# Altium schematic sheet digital-isolator-3in-1out-power.SchDoc
size A3; DocumentNumber: 3; SheetNumber: 3; SheetTotal: 5; SheetDescription: Digital Isolator 3x in / 1x out with power
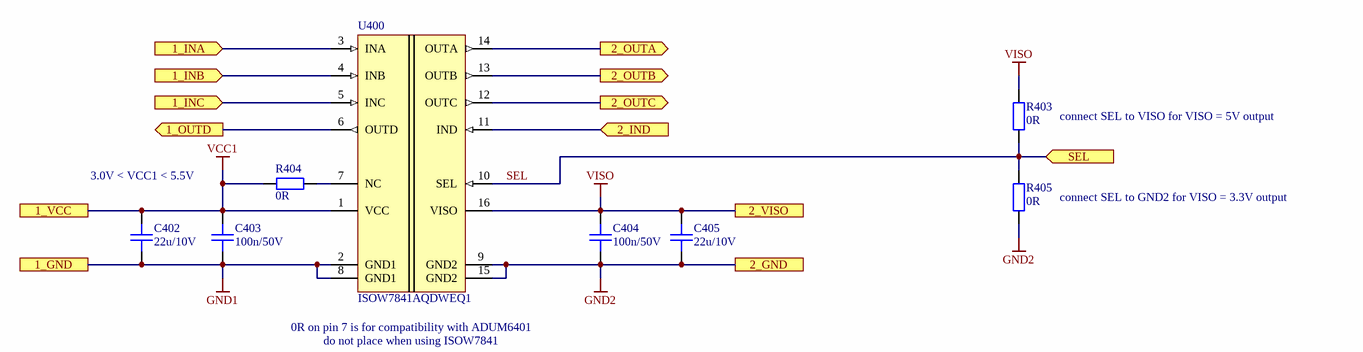
[diagram p0: digital-isolator-3in-1out-power.SchDoc]

## Parts
C402  22u/10V  [CAPC3216X18N]
C403  100n/50V  [CAPC1608X08N]
C404  100n/50V  [CAPC1608X08N]
C405  22u/10V  [CAPC3216X18N]
R403  0R  [RESC1608X05N]
R404  0R  [RESC1608X05N]
R405  0R  [RESC1608X05N]
U400  ISOW7841AQDWEQ1  [TI_DWE0016A]

## Ports
1_GND, 1_INA (in), 1_INB (in), 1_INC (in), 1_OUTD (out), 1_VCC, 2_GND, 2_IND (in), 2_OUTA (out), 2_OUTB (out), 2_OUTC (out), 2_VISO, SEL (in)

## Nets
GND1: C402.1 C403.1 U400.2(GND1) U400.8(GND1) ; port 1_GND
GND2: C404.1 C405.1 R405.1 U400.9(GND2) U400.15(GND2) ; port 2_GND
VCC1: C402.2 C403.2 R404.2 U400.1(VCC) ; port 1_VCC
VISO: C404.2 C405.2 R403.2 U400.16(VISO) ; port 2_VISO
1_INA: U400.3(INA) ; port 1_INA
1_INB: U400.4(INB) ; port 1_INB
1_INC: U400.5(INC) ; port 1_INC
1_OUTD: U400.6(OUTD) ; port 1_OUTD
2_IND: U400.11(IND) ; port 2_IND
2_OUTA: U400.14(OUTA) ; port 2_OUTA
2_OUTB: U400.13(OUTB) ; port 2_OUTB
2_OUTC: U400.12(OUTC) ; port 2_OUTC
SEL: R403.1 R405.2 U400.10(SEL) ; port SEL
NetR404_1: R404.1 U400.7(NC)

## Notes on the sheet
- (near R403) connect SEL to VISO for VISO = 5V output
- 3.0V < VCC1 < 5.5V
- (near R405) connect SEL to GND2 for VISO = 3.3V output
- (near U400) 0R on pin 7 is for compatibility with ADUM6401
- do not place when using ISOW7841
- Fraunhofer IISB
- Schottkystr. 10
- developed by:
- 91058 Erlangen
- Germany
- Author
- Project
- License
- Description
- File
- Version
- Release Date
- Sheet
- foxbms.org <https://foxbms.org>
- www.iisb.fraunhofer.de <https://www.iisb.fraunhofer.de/>
- foxBMS Team
- /

## Library data of the parts
C402 C405 = gen_C_ceramic_22u_10V_X7R_1206: MLCC; Capacitance: 22u; Rated Voltage: 10V; Dielectric: X7R; Case EIA: 1206; Case Metric: 3216; Automotive Qualified: True; Part Number: gen_C_ceramic_22u_10V_X7R_1206; Supplier 1: Digikey; Supplier Part Number 1: 587-4243-1-ND
C403 C404 = gen_C_ceramic_100n_50V_X7R_0603: MLCC; Capacitance: 100n; Rated Voltage: 50V; Dielectric: X7R; Case EIA: 0603; Case Metric: 1608; PnP Package: 0603C; PnP Value: 100nF/50V/X7R; PnP equipped: x; Automotive Qualified: True; AEC-Q Norm: AEC-Q200; Part Number: gen_C_ceramic_100n_50V_X7R_0603; Supplier 1: Farnell; Supplier Part Number 1: 2525267; ECCN: EAR99; Supplier 2: Digikey; Supplier Part Number 2: 490-6049-1-ND
R403-R405 = gen_R_0R_0603: SMD Resistor 0R 0603; Power: 0.1W; Case EIA: 0603; Case Metric: 1608; Maximum Working Voltage: 75V; PnP Package: 0603R; Automotive Qualified: True; PnP equipped: x; Part Number: gen_R_0R_0603; Operating Temperature: -55°C - +155°C; Resistance: 0R; Series: Jumper; PnP Value: 0R; Supplier 1: Farnell; Supplier Part Number 1: 2616580
U400 = ISOW7841AQDWEQ1: Automotive High-Performance, 5000-VRMS Reinforced Quad-Channel Digital Isolator With Integrated High-Efficiency, Low-Emissions DC-DC Converter; Manufacturer: Texas Instruments; PnP Package: SOIC-16; Automotive Qualified: True; AEC-Q Norm: AEC-Q100; AEC-Q Grade: Grade 1; Part Number: ISOW7841AQDWEQ1; Part Name: ISOW7841AQDWEQ1; Operating Temperature: −40°C - +125°C; ComponentLink1Description: Datasheet; ComponentLink1URL: https://www.ti.com/lit/ds/symlink/isow7841a-q1.pdf?ts=1619516874236; Supplier 1: Digikey; Supplier Part Number 1: 296-ISOW7841AQDWEQ1-ND; Supplier 2: Mouser; Supplier Part Number 2: 595-ISOW7841AQDWEQ1; ECCN: EAR99